# EAGLE design led_cube_4x4x8_v1 (EAGLE 9.6.2)
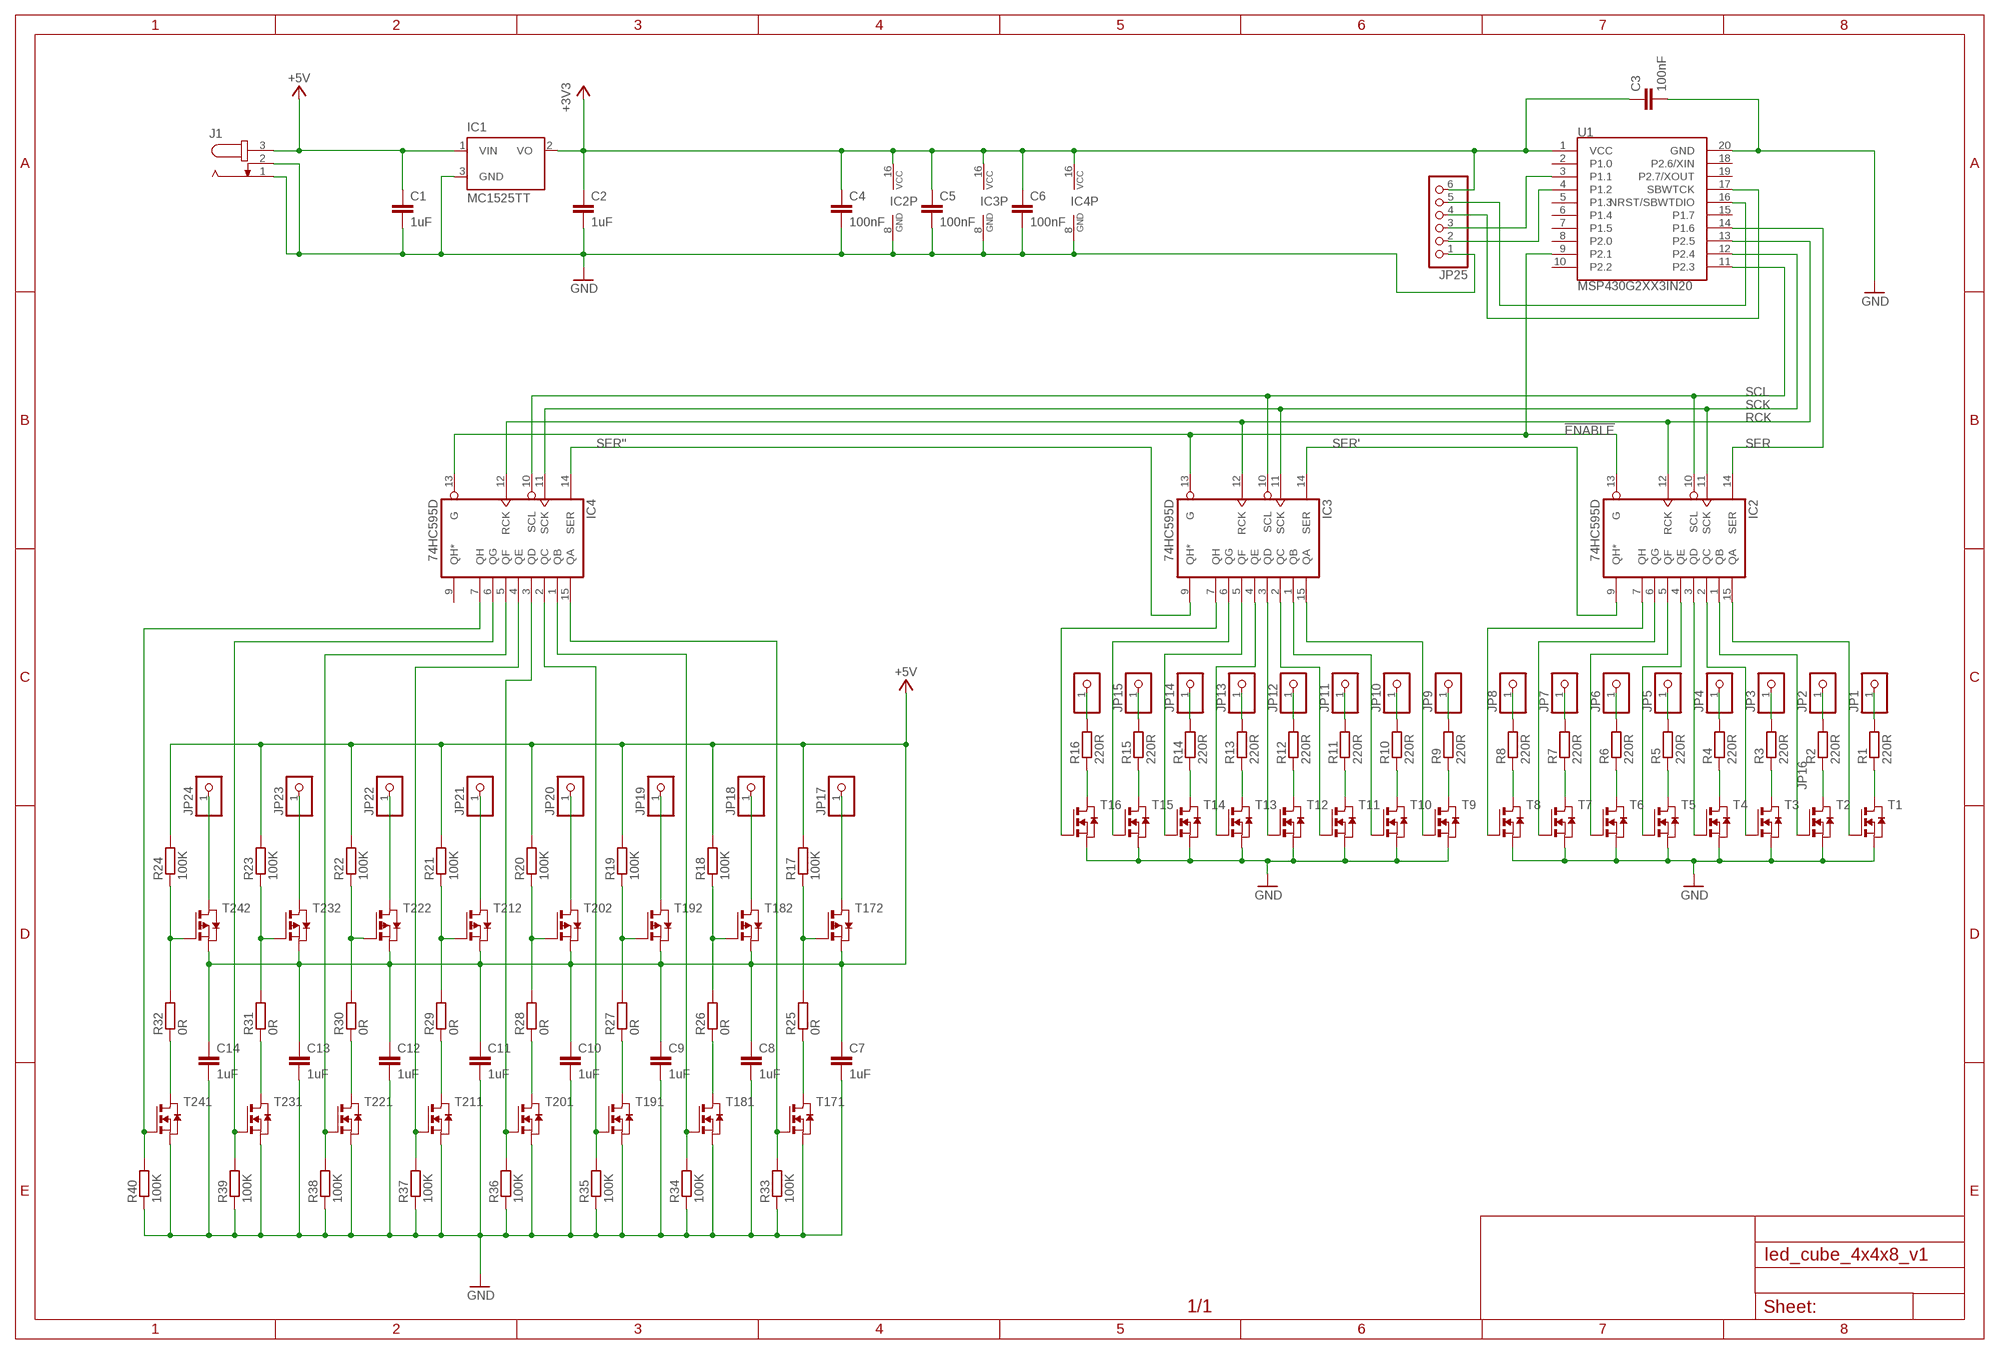
[diagram p0: schematic, sheet 1]

## Parts
C1  1uF  C-EUC0603  [C0603]
C2  1uF  C-EUC0603  [C0603]
C3  100nF  C-EUC0603  [C0603]
C4  100nF  C-EUC0603  [C0603]
C5  100nF  C-EUC0603  [C0603]
C6  100nF  C-EUC0603  [C0603]
C7  1uF  C-EUC0603  [C0603]
C8  1uF  C-EUC0603  [C0603]
C9  1uF  C-EUC0603  [C0603]
C10  1uF  C-EUC0603  [C0603]
C11  1uF  C-EUC0603  [C0603]
C12  1uF  C-EUC0603  [C0603]
C13  1uF  C-EUC0603  [C0603]
C14  1uF  C-EUC0603  [C0603]
IC1  MC1525TT  [SOT23]
IC2  74HC595D  [SO16]
IC3  74HC595D  [SO16]
IC4  74HC595D  [SO16]
J1  JACK-PLUG0  [SPC4077]
JP1  PINHD-1X1  [1X01]
JP2  PINHD-1X1  [1X01]
JP3  PINHD-1X1  [1X01]
JP4  PINHD-1X1  [1X01]
JP5  PINHD-1X1  [1X01]
JP6  PINHD-1X1  [1X01]
JP7  PINHD-1X1  [1X01]
JP8  PINHD-1X1  [1X01]
JP9  PINHD-1X1  [1X01]
JP10  PINHD-1X1  [1X01]
JP11  PINHD-1X1  [1X01]
JP12  PINHD-1X1  [1X01]
JP13  PINHD-1X1  [1X01]
JP14  PINHD-1X1  [1X01]
JP15  PINHD-1X1  [1X01]
JP16  PINHD-1X1  [1X01]
JP17  PINHD-1X1  [1X01]
JP18  PINHD-1X1  [1X01]
JP19  PINHD-1X1  [1X01]
JP20  PINHD-1X1  [1X01]
JP21  PINHD-1X1  [1X01]
JP22  PINHD-1X1  [1X01]
JP23  PINHD-1X1  [1X01]
JP24  PINHD-1X1  [1X01]
JP25  PINHD-1X6  [1X06]
R1  220R  R-EU_R0603  [R0603]
R2  220R  R-EU_R0603  [R0603]
R3  220R  R-EU_R0603  [R0603]
R4  220R  R-EU_R0603  [R0603]
R5  220R  R-EU_R0603  [R0603]
R6  220R  R-EU_R0603  [R0603]
R7  220R  R-EU_R0603  [R0603]
R8  220R  R-EU_R0603  [R0603]
R9  220R  R-EU_R0603  [R0603]
R10  220R  R-EU_R0603  [R0603]
R11  220R  R-EU_R0603  [R0603]
R12  220R  R-EU_R0603  [R0603]
R13  220R  R-EU_R0603  [R0603]
R14  220R  R-EU_R0603  [R0603]
R15  220R  R-EU_R0603  [R0603]
R16  220R  R-EU_R0603  [R0603]
R17  100K  R-EU_R0603  [R0603]
R18  100K  R-EU_R0603  [R0603]
R19  100K  R-EU_R0603  [R0603]
R20  100K  R-EU_R0603  [R0603]
R21  100K  R-EU_R0603  [R0603]
R22  100K  R-EU_R0603  [R0603]
R23  100K  R-EU_R0603  [R0603]
R24  100K  R-EU_R0603  [R0603]
R25  0R  R-EU_R0603  [R0603]
R26  0R  R-EU_R0603  [R0603]
R27  0R  R-EU_R0603  [R0603]
R28  0R  R-EU_R0603  [R0603]
R29  0R  R-EU_R0603  [R0603]
R30  0R  R-EU_R0603  [R0603]
R31  0R  R-EU_R0603  [R0603]
R32  0R  R-EU_R0603  [R0603]
R33  100K  R-EU_R0603  [R0603]
R34  100K  R-EU_R0603  [R0603]
R35  100K  R-EU_R0603  [R0603]
R36  100K  R-EU_R0603  [R0603]
R37  100K  R-EU_R0603  [R0603]
R38  100K  R-EU_R0603  [R0603]
R39  100K  R-EU_R0603  [R0603]
R40  100K  R-EU_R0603  [R0603]
T1  NMOSSOT23  [SOT-23]
T2  NMOSSOT23  [SOT-23]
T3  NMOSSOT23  [SOT-23]
T4  NMOSSOT23  [SOT-23]
T5  NMOSSOT23  [SOT-23]
T6  NMOSSOT23  [SOT-23]
T7  NMOSSOT23  [SOT-23]
T8  NMOSSOT23  [SOT-23]
T9  NMOSSOT23  [SOT-23]
T10  NMOSSOT23  [SOT-23]
T11  NMOSSOT23  [SOT-23]
T12  NMOSSOT23  [SOT-23]
T13  NMOSSOT23  [SOT-23]
T14  NMOSSOT23  [SOT-23]
T15  NMOSSOT23  [SOT-23]
T16  NMOSSOT23  [SOT-23]
T17  PN_MOSFET-SOT23-6  [SOT23-6]
T18  PN_MOSFET-SOT23-6  [SOT23-6]
T19  PN_MOSFET-SOT23-6  [SOT23-6]
T20  PN_MOSFET-SOT23-6  [SOT23-6]
T21  PN_MOSFET-SOT23-6  [SOT23-6]
T22  PN_MOSFET-SOT23-6  [SOT23-6]
T23  PN_MOSFET-SOT23-6  [SOT23-6]
T24  PN_MOSFET-SOT23-6  [SOT23-6]
U1  MSP430G2XX3IN20  [DIL20]

## Nets
!ENABLE: IC2.13(G) IC3.13(G) IC4.13(G) U1.9(P2.1)
+3V3 [power]: C2.1 C3.1 C4.1 C5.1 C6.1 IC1.2(VO) IC2.16(VCC) IC3.16(VCC) IC4.16(VCC) JP25.6 U1.1(VCC)
+5V [led_power]: C1.1 C7.1 C8.1 C9.1 C10.1 C11.1 C12.1 C13.1 C14.1 IC1.1(VIN) J1.3 R17.2 R18.2 R19.2 R20.2 R21.2 R22.2 R23.2 R24.2 T17.2(2:S) T18.2(2:S) T19.2(2:S) T20.2(2:S) T21.2(2:S) T22.2(2:S) T23.2(2:S) T24.2(2:S)
GND: C1.2 C2.2 C3.2 C4.2 C5.2 C6.2 C7.2 C8.2 C9.2 C10.2 C11.2 C12.2 C13.2 C14.2 IC1.3(GND) IC2.8(GND) IC3.8(GND) IC4.8(GND) J1.1 J1.2 JP25.1 R33.1 R34.1 R35.1 R36.1 R37.1 R38.1 R39.1 R40.1 T1.2(S) T2.2(S) T3.2(S) T4.2(S) T5.2(S) T6.2(S) T7.2(S) T8.2(S) T9.2(S) T10.2(S) T11.2(S) T12.2(S) T13.2(S) T14.2(S) T15.2(S) T16.2(S) T17.5(1:S) T18.5(1:S) T19.5(1:S) T20.5(1:S) T21.5(1:S) T22.5(1:S) T23.5(1:S) T24.5(1:S) U1.20(GND)
N$2: R22.1 R30.2 T22.3(2:G)
N$7 [led_power]: R8.1 T8.1(D)
N$8 [led_power]: R7.1 T7.1(D)
N$9 [led_power]: R6.1 T6.1(D)
N$10 [led_power]: R5.1 T5.1(D)
N$11 [led_power]: R4.1 T4.1(D)
N$12 [led_power]: R3.1 T3.1(D)
N$13 [led_power]: R2.1 T2.1(D)
N$14 [led_power]: R1.1 T1.1(D)
N$15: IC2.6(QG) T7.3(G)
N$16: IC2.7(QH) T8.3(G)
N$17: IC2.5(QF) T6.3(G)
N$18: IC2.4(QE) T5.3(G)
N$19: IC2.3(QD) T4.3(G)
N$20: IC2.2(QC) T3.3(G)
N$21: IC2.1(QB) T2.3(G)
N$22: IC2.15(QA) T1.3(G)
N$23 [led_power]: JP8.1 R8.2
N$24 [led_power]: JP7.1 R7.2
N$25 [led_power]: JP6.1 R6.2
N$26 [led_power]: JP5.1 R5.2
N$27 [led_power]: JP4.1 R4.2
N$28 [led_power]: JP3.1 R3.2
N$29 [led_power]: JP2.1 R2.2
N$30 [led_power]: JP1.1 R1.2
N$31 [led_power]: R16.1 T16.1(D)
N$32 [led_power]: R15.1 T15.1(D)
N$33 [led_power]: R14.1 T14.1(D)
N$34 [led_power]: R13.1 T13.1(D)
N$35 [led_power]: R12.1 T12.1(D)
N$36 [led_power]: R11.1 T11.1(D)
N$37 [led_power]: R10.1 T10.1(D)
N$38 [led_power]: R9.1 T9.1(D)
N$39: IC3.6(QG) T15.3(G)
N$40: IC3.7(QH) T16.3(G)
N$41: IC3.5(QF) T14.3(G)
N$42: IC3.4(QE) T13.3(G)
N$43: IC3.3(QD) T12.3(G)
N$44: IC3.2(QC) T11.3(G)
N$45: IC3.1(QB) T10.3(G)
N$46: IC3.15(QA) T9.3(G)
N$47 [led_power]: JP16.1 R16.2
N$48 [led_power]: JP15.1 R15.2
N$49 [led_power]: JP14.1 R14.2
N$50 [led_power]: JP13.1 R13.2
N$51 [led_power]: JP12.1 R12.2
N$52 [led_power]: JP11.1 R11.2
N$53 [led_power]: JP10.1 R10.2
N$54 [led_power]: JP9.1 R9.2
N$56: R23.1 R31.2 T23.3(2:G)
N$57: R21.1 R29.2 T21.3(2:G)
N$58: R20.1 R28.2 T20.3(2:G)
N$59: R19.1 R27.2 T19.3(2:G)
N$60: R18.1 R26.2 T18.3(2:G)
N$61: R17.1 R25.2 T17.3(2:G)
N$62 [led_power]: JP24.1 T24.4(2:D)
N$63 [led_power]: JP23.1 T23.4(2:D)
N$64: IC4.7(QH) R40.2 T24.1(1:G)
N$65 [led_power]: JP22.1 T22.4(2:D)
N$66 [led_power]: JP21.1 T21.4(2:D)
N$67 [led_power]: JP20.1 T20.4(2:D)
N$68 [led_power]: JP19.1 T19.4(2:D)
N$69 [led_power]: JP18.1 T18.4(2:D)
N$70 [led_power]: JP17.1 T17.4(2:D)
N$71: IC4.3(QD) R36.2 T20.1(1:G)
N$72: R24.1 R32.2 T24.3(2:G)
N$73: IC4.6(QG) R39.2 T23.1(1:G)
N$74: IC4.5(QF) R38.2 T22.1(1:G)
N$75: IC4.4(QE) R37.2 T21.1(1:G)
N$76: R32.1 T24.6(1:D)
N$77: IC4.2(QC) R35.2 T19.1(1:G)
N$78: IC4.1(QB) R34.2 T18.1(1:G)
N$79: IC4.15(QA) R33.2 T17.1(1:G)
N$81: JP25.2 U1.4(P1.2)
N$82: JP25.3 U1.3(P1.1)
N$83: JP25.4 U1.17(SBWTCK)
N$84: JP25.5 U1.16(NRST/SBWTDIO)
N$85: R31.1 T23.6(1:D)
N$86: R30.1 T22.6(1:D)
N$87: R29.1 T21.6(1:D)
N$88: R28.1 T20.6(1:D)
N$89: R27.1 T19.6(1:D)
N$90: R26.1 T18.6(1:D)
N$91: R25.1 T17.6(1:D)
RCK: IC2.12(RCK) IC3.12(RCK) IC4.12(RCK) U1.13(P2.5)
SCK: IC2.11(SCK) IC3.11(SCK) IC4.11(SCK) U1.12(P2.4)
SCL: IC2.10(SCL) IC3.10(SCL) IC4.10(SCL) U1.11(P2.3)
SER: IC2.14(SER) U1.14(P1.6)
SER': IC2.9(QH*) IC3.14(SER)
SER'': IC3.9(QH*) IC4.14(SER)
Unconnected: IC4.9(QH*) U1.2(P1.0) U1.5(P1.3) U1.6(P1.4) U1.7(P1.5) U1.8(P2.0) U1.10(P2.2) U1.15(P1.7) U1.18(P2.6/XIN) U1.19(P2.7/XOUT)

## Library data of the parts
C1-C14 = custom:C-EU: CAPACITOR, European symbol; SPICEPREFIX: C
IC1 = microchip:MC15*: 2.5V and 4.096V Voltage References Source: http://www.microchip.com .. 21653b.pdf; OC_FARNELL: unknown; OC_NEWARK: unknown
IC2-IC4 = custom:74*595: 8-bit SHIFT REGISTER, output latch
J1 = custom:JACK-PLUG: DC POWER JACK Power Jack, DC, Right Angle, Through Hole, Rated 5A at 16VDC, PC Terminals Distributor: Farnell (www.Farnell.de) Drawing: 84N1161.pdf / 84N1162.pdf Manufacturer: SPC Technology (www.spctechnology.com) Type: SPC4077 / SPC 4078; OC_FARNELL: unknown; OC_NEWARK: unknown
JP1-JP24 = pinhead:PINHD-1X1: PIN HEADER
JP25 = pinhead:PINHD-1X6: PIN HEADER
R1-R40 = rcl:R-EU_: RESISTOR, European symbol; SPICEPREFIX: R
T1-T16 = zetex:NMOSSOT23: MOS FET; OC_FARNELL: unknown; OC_NEWARK: unknown
T17-T24 = custom:PN_MOSFET-: DUAL N AND P-CHANNEL ENHANCEMENT MODE MOSFET Source: Data sheet <http://www.farnell.com/datasheets/1693880.pdf>
U1 = custom:MSP430G2XX3

## Net classes
0 default: width 0.254 mm, drill 0.3 mm, clearance 0.254 mm
1 led_power: width 0.635 mm, drill 0.3 mm, clearance 0.254 mm
2 power: width 0.508 mm, drill 0.3 mm, clearance 0.254 mm

## Board
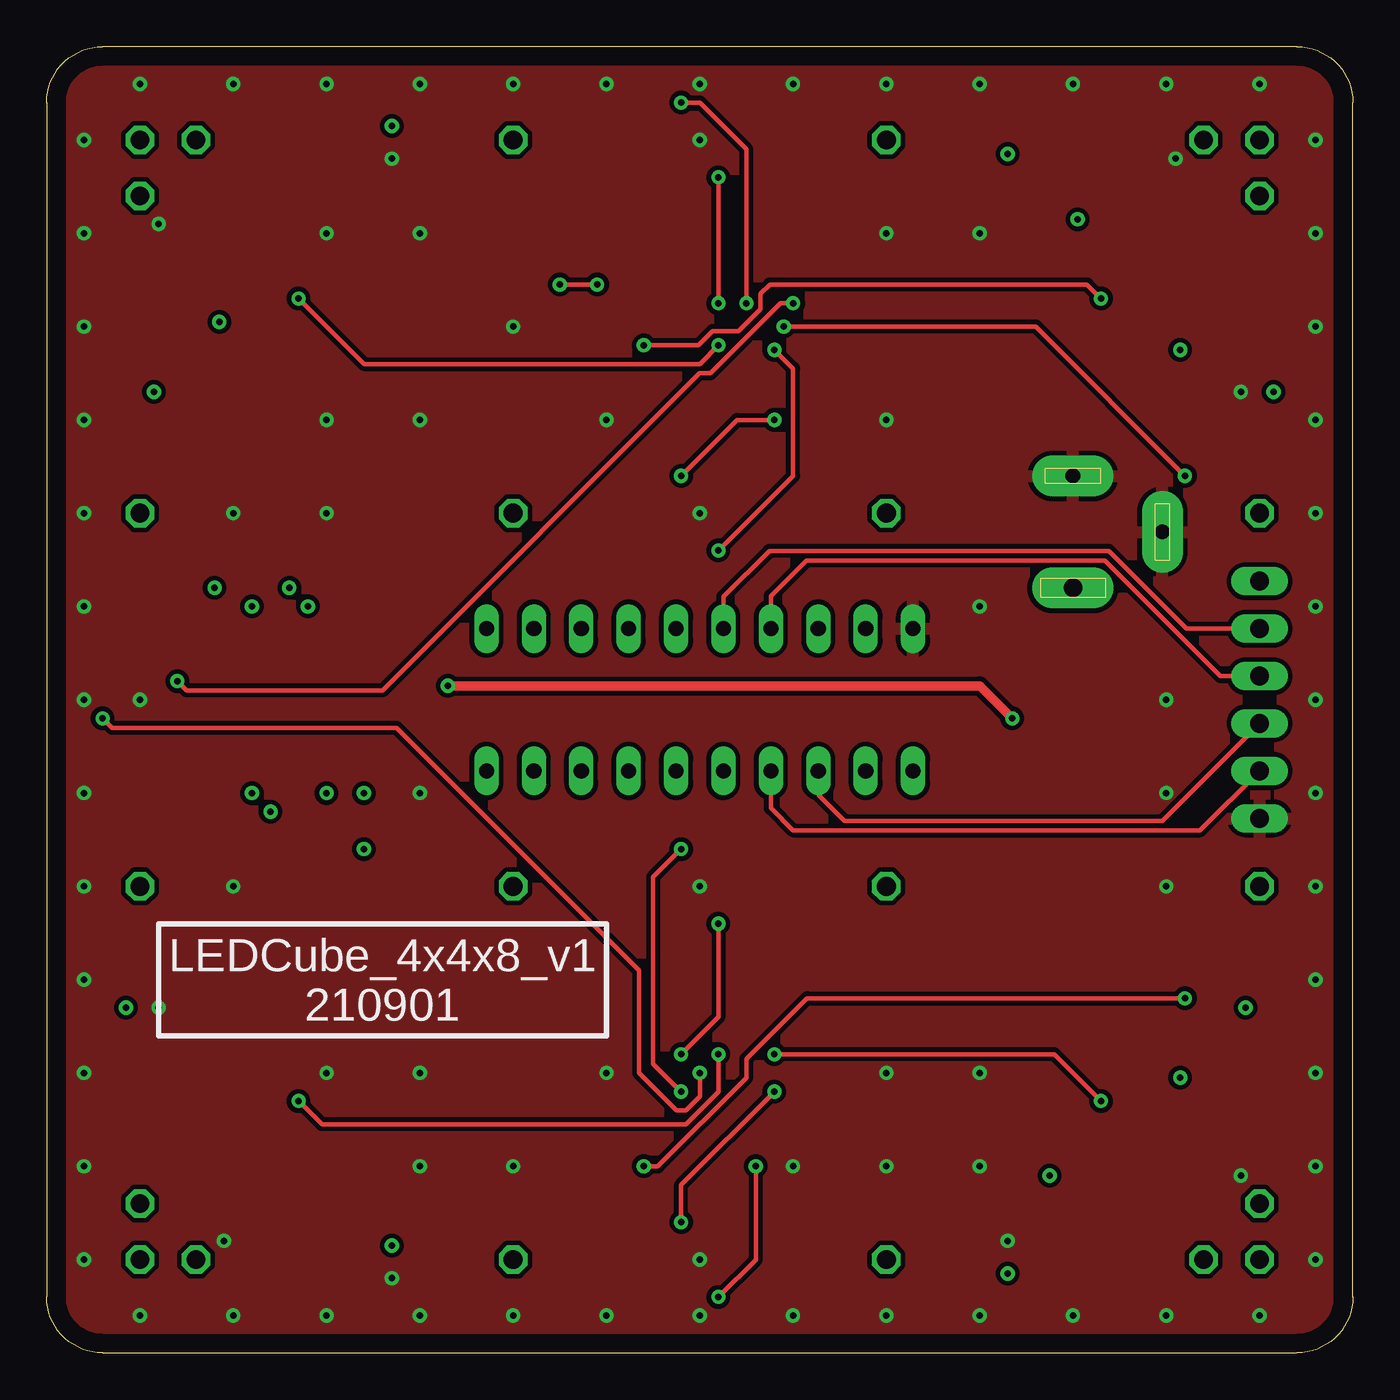
[diagram p1: board, top side]
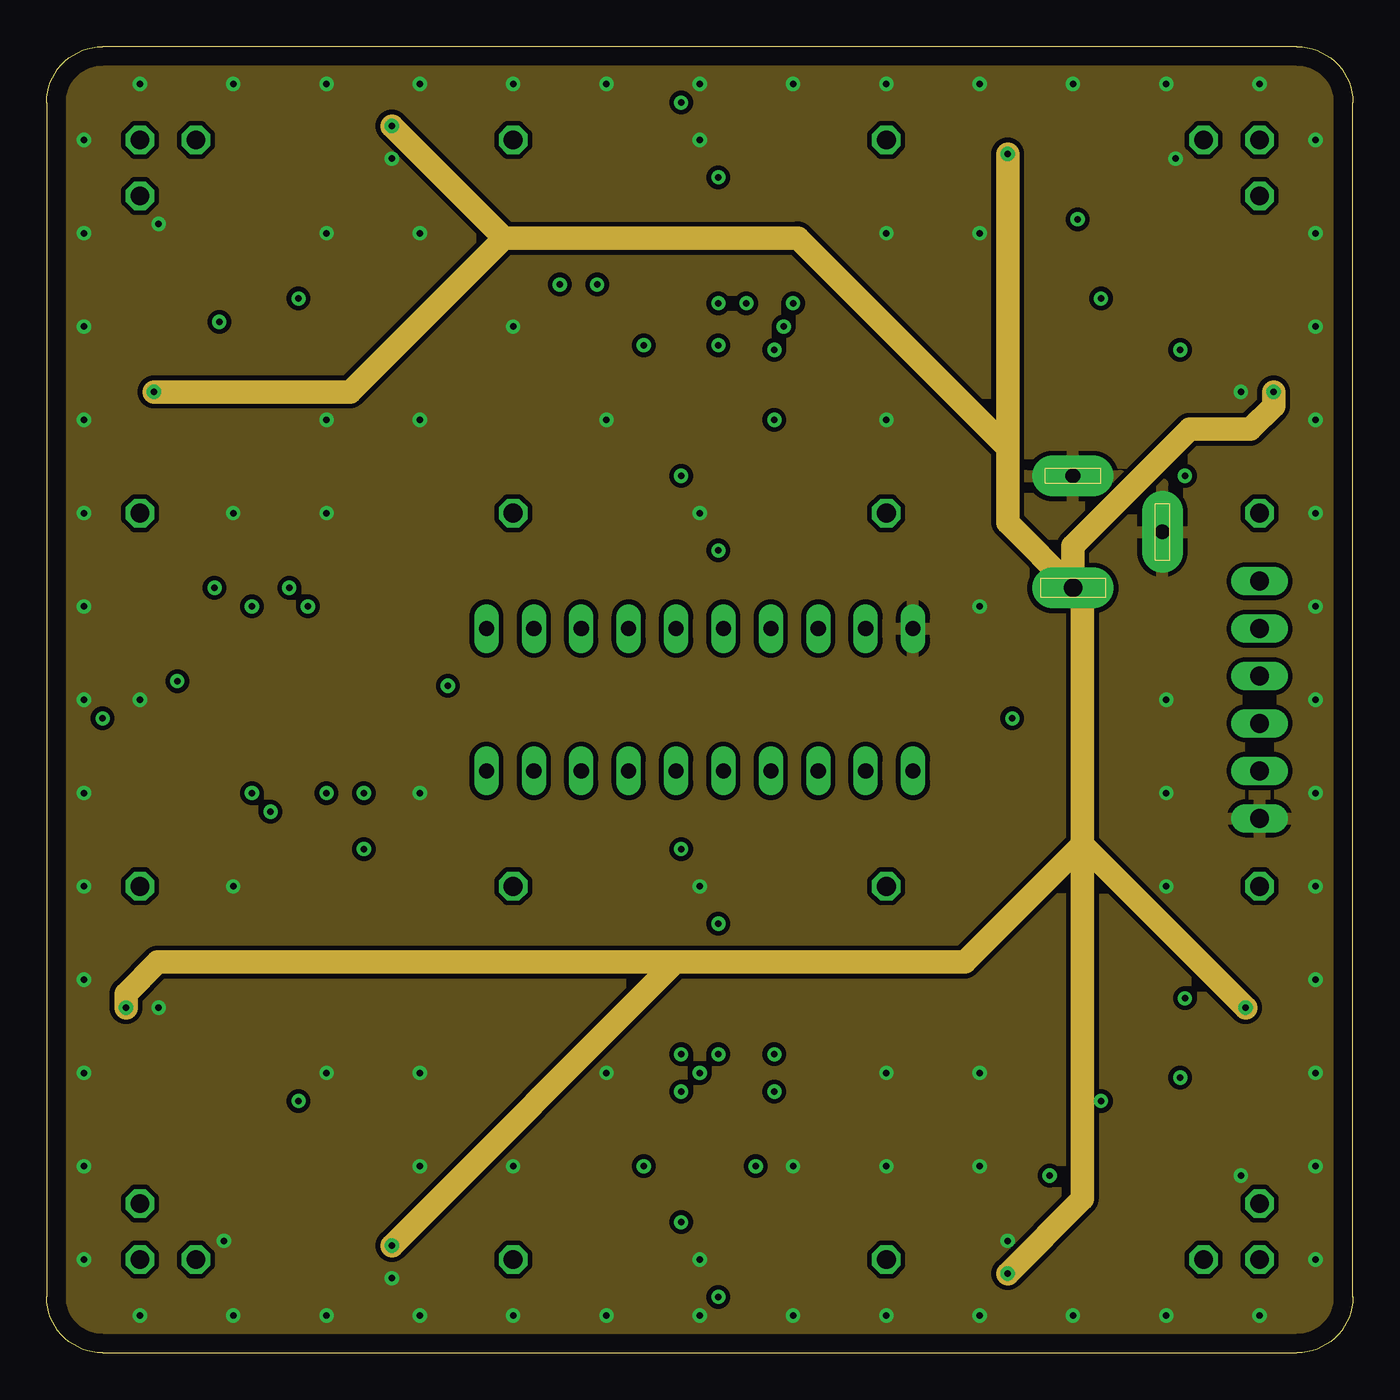
[diagram p2: board, inner layer Route2]
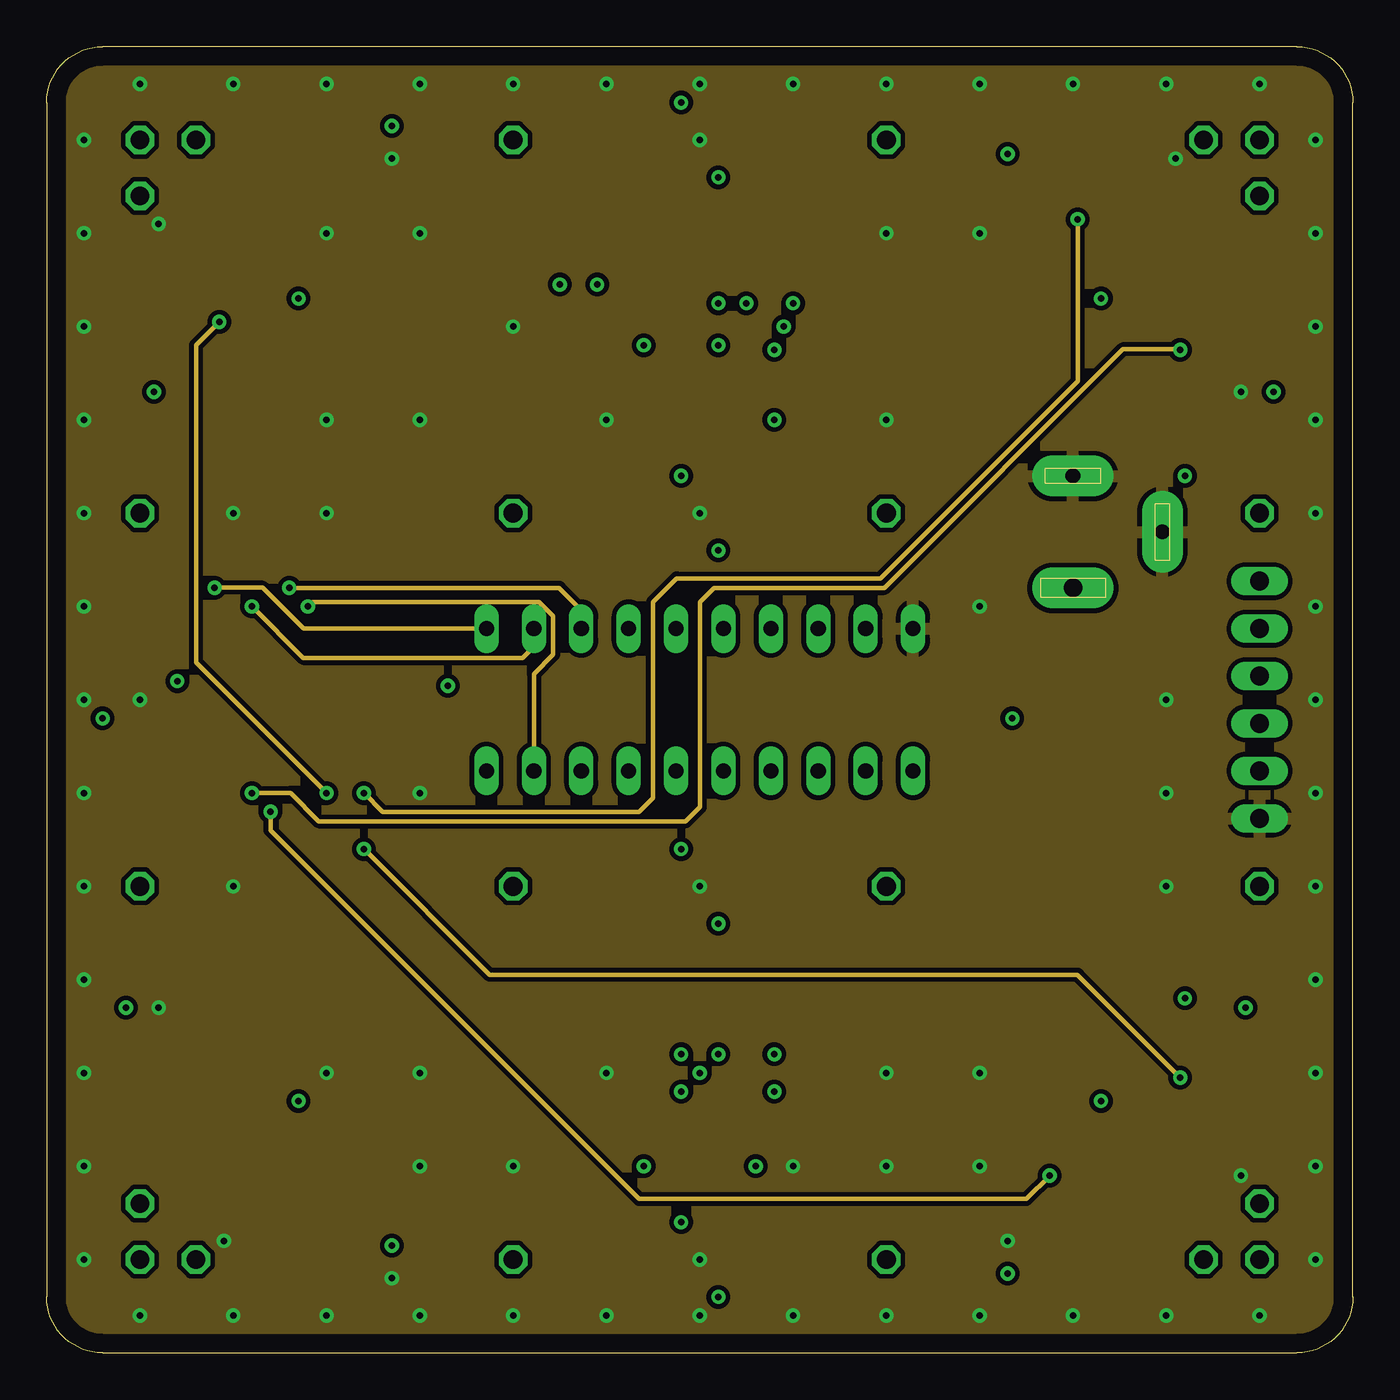
[diagram p3: board, inner layer Route15]
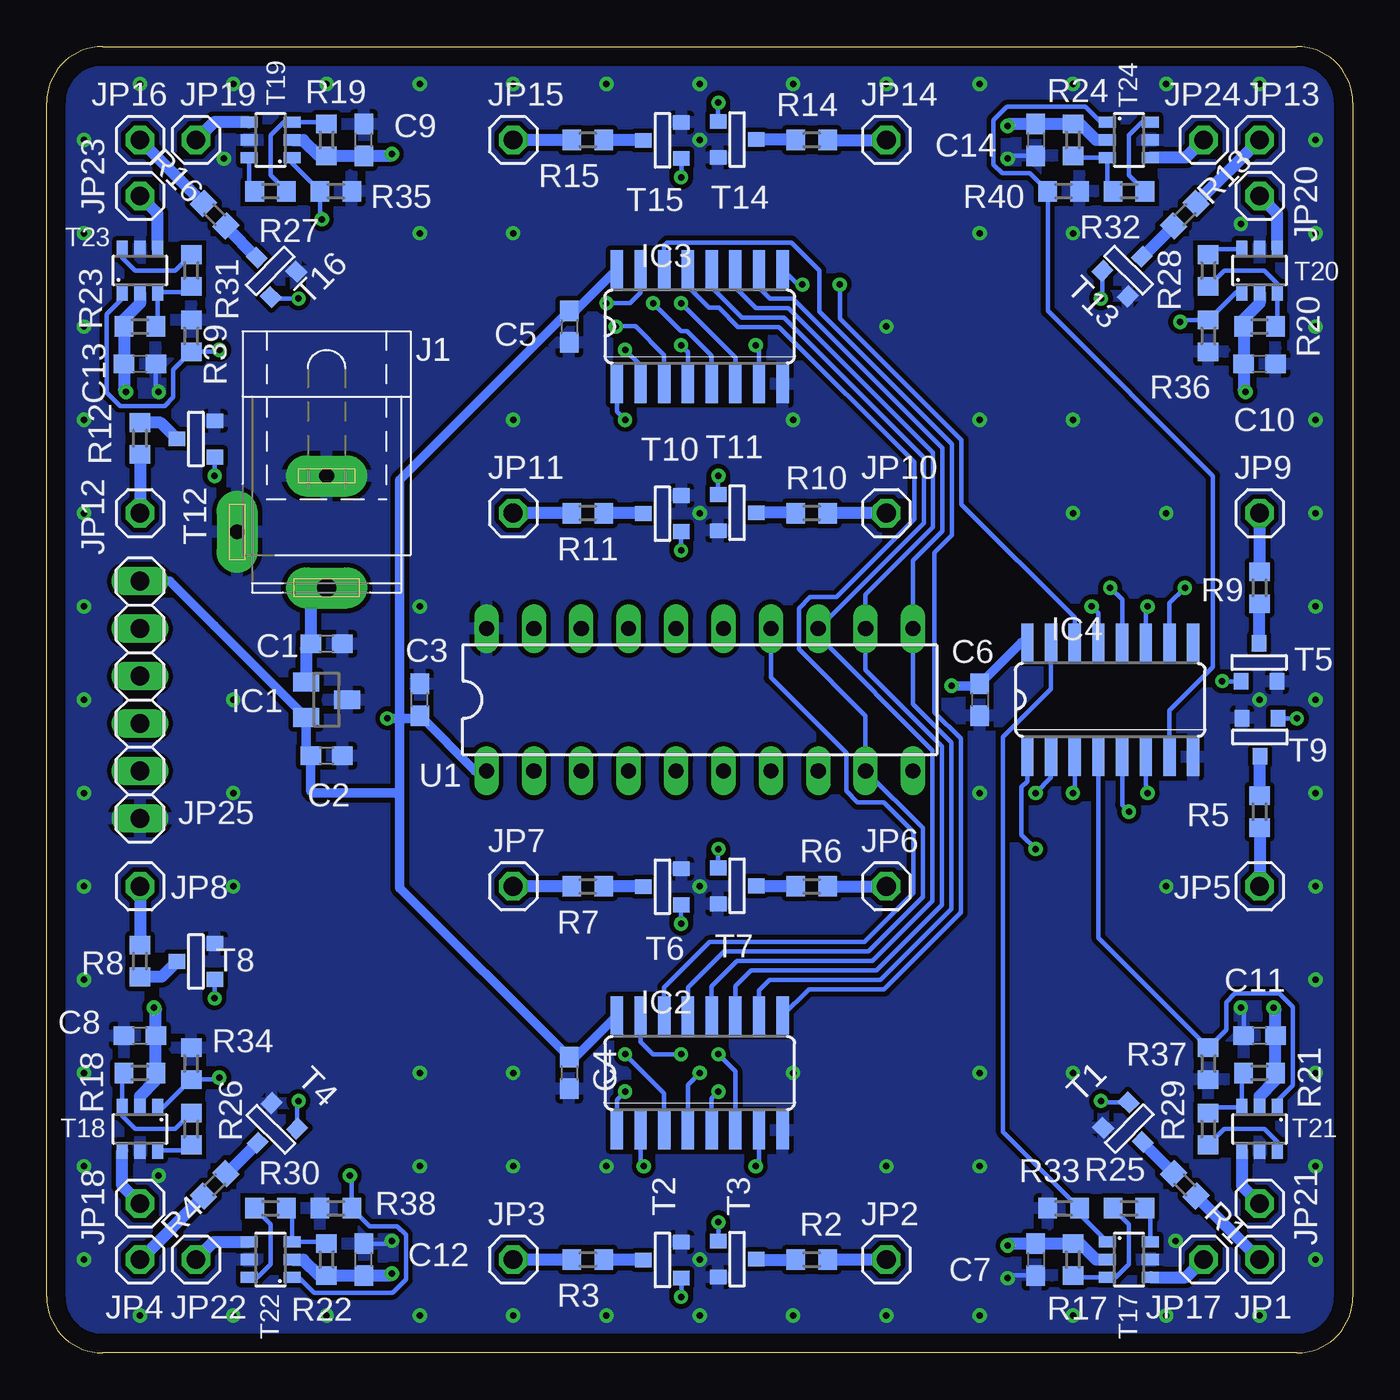
[diagram p4: board, bottom side, seen from below]

Size 70 x 70 mm. Coordinates in mm from the lower left corner, seen from the top.
Outline: 3,0 67,0 arc90 70,3 70,67 arc90 67,70 3,70 arc90 0,67 0,3 arc90 3,0
Copper layers (1*2+15*16): Top 0.035mm / dielectric 1.5mm / Route2 0.035mm / dielectric 0.15mm / Route15 0.035mm / dielectric 0.2mm / Bottom 0.035mm
Design rules "default *": minimum track width 6mil, minimum drill 0.35mm, track to track 6mil, track to pad 6mil, pad to pad 6mil, via to via 6mil, smd to smd 6mil, copper to edge 40mil, drill to drill 6mil, minimum pad ring 10mil, minimum via ring 8mil, stop-mask expansion 4mil, vias tented up to drill 0mil, thermal gap 10mil

### Footprints (pad centres in the part's own frame; a part is rotated, then mirrored left to right if it is on the bottom)
C0603 = smd 1.1 x 1: 1 -0.85,0; 2 0.85,0
SOT23 = smd 1 x 1.4: 1 -0.95,-1.1; 2 0.95,-1.1; 3 0,1.1
SO16 = smd 0.66 x 2.032: 1 -4.445,-3.073; 2 -3.175,-3.073; 3 -1.905,-3.073; 4 -0.635,-3.073; 5 0.635,-3.073; 6 1.905,-3.073; 7 3.175,-3.073; 8 4.445,-3.073; 9 4.445,3.073; 10 3.175,3.073; 11 1.905,3.073; 12 0.635,3.073; 13 -0.635,3.073; 14 -1.905,3.073; 15 -3.175,3.073; 16 -4.445,3.073
SPC4077 = drill 0.8 pad 2.184 long: 1 -3,0; 2 0,-4.8 | drill 1 pad 2.184 long: 3 3,0
1X01 = drill 1.016 octagon: 1 0,0
1X06 = drill 1.016 long: 1 -6.35,0; 2 -3.81,0; 3 -1.27,0; 4 1.27,0; 5 3.81,0; 6 6.35,0
R0603 = smd 1 x 1.1: 1 -0.85,0; 2 0.85,0
SOT-23 = smd 0.787 x 0.889: 1 0.025,-1.016; 2 -0.94,1.016; 3 0.991,1.016
SOT23-6 = smd 0.6 x 0.9: 1 -0.95,-1.15; 2 0,-1.15; 3 0.95,-1.15; 4 0.95,1.15; 5 0,1.15; 6 -0.95,1.15
DIL20 = drill 0.813 long: 1 -11.43,-3.81; 2 -8.89,-3.81; 3 -6.35,-3.81; 4 -3.81,-3.81; 5 -1.27,-3.81; 6 1.27,-3.81; 7 3.81,-3.81; 8 6.35,-3.81; 9 8.89,-3.81; 10 11.43,-3.81; 11 11.43,3.81; 12 8.89,3.81; 13 6.35,3.81; 14 3.81,3.81; 15 1.27,3.81; 16 -1.27,3.81; 17 -3.81,3.81; 18 -6.35,3.81; 19 -8.89,3.81; 20 -11.43,3.81

### Placement (x,y rotation side)
C1  55,38 0 bottom
C2  55,32 0 bottom
C3  50,35 90 bottom
C4  42,15 270 bottom
C5  42,55 270 bottom
C6  20,35 270 bottom
C7  17,5 270 bottom
C8  65,17 180 bottom
C9  53,65 90 bottom
C10  5,53 0 bottom
C11  5,17 180 bottom
C12  53,5 90 bottom
C13  65,53 0 bottom
C14  17,65 270 bottom
IC1  55,35 270 bottom
IC2  35,15 0 bottom
IC3  35,55 0 bottom
IC4  13,35 0 bottom
J1  55,44 270 bottom
JP1  5,5 0 bottom
JP2  25,5 0 bottom
JP3  45,5 0 bottom
JP4  65,5 0 bottom
JP5  5,25 0 bottom
JP6  25,25 0 bottom
JP7  45,25 0 bottom
JP8  65,25 0 bottom
JP9  5,45 0 bottom
JP10  25,45 0 bottom
JP11  45,45 0 bottom
JP12  65,45 0 bottom
JP13  5,65 0 bottom
JP14  25,65 0 bottom
JP15  45,65 0 bottom
JP16  65,65 0 bottom
JP17  8,5 0 bottom
JP18  65,8 0 bottom
JP19  62,65 0 bottom
JP20  5,62 0 bottom
JP21  5,8 0 bottom
JP22  62,5 0 bottom
JP23  65,62 0 bottom
JP24  8,65 0 bottom
JP25  65,35 90 bottom
R1  9,9 315 bottom
R2  29,5 0 bottom
R3  41,5 180 bottom
R4  61,9 225 bottom
R5  5,29 270 bottom
R6  29,25 0 bottom
R7  41,25 180 bottom
R8  65,21 90 bottom
R9  5,41 90 bottom
R10  29,45 0 bottom
R11  41,45 180 bottom
R12  65,49 270 bottom
R13  9,61 45 bottom
R14  29,65 0 bottom
R15  41,65 180 bottom
R16  61,61 135 bottom
R17  15,5 90 bottom
R18  65,15 0 bottom
R19  55,65 270 bottom
R20  5,55 180 bottom
R21  5,15 0 bottom
R22  55,5 270 bottom
R23  65,55 180 bottom
R24  15,65 90 bottom
R25  12,7.75 180 bottom
R26  62.25,12 90 bottom
R27  58,62.25 0 bottom
R28  7.75,58 270 bottom
R29  7.75,12 90 bottom
R30  58,7.75 0 bottom
R31  62.25,58 270 bottom
R32  12,62.25 180 bottom
R33  15.5,7.75 0 bottom
R34  62.25,15.5 270 bottom
R35  54.5,62.25 180 bottom
R36  7.75,54.5 90 bottom
R37  7.75,15.5 90 bottom
R38  54.5,7.75 0 bottom
R39  62.25,54.5 270 bottom
R40  15.5,62.25 180 bottom
T1  12,12 45 bottom
T2  33,5 90 bottom
T3  37,5 270 bottom
T4  58,12 315 bottom
T5  5,33 0 bottom
T6  33,25 90 bottom
T7  37,25 270 bottom
T8  62,21 270 bottom
T9  5,37 180 bottom
T10  33,45 90 bottom
T11  37,45 270 bottom
T12  62,49 270 bottom
T13  12,58 135 bottom
T14  33,65 90 bottom
T15  37,65 270 bottom
T16  58,58 225 bottom
T17  12,5 270 bottom
T18  65,12 180 bottom
T19  58,65 90 bottom
T20  5,58 0 bottom
T21  5,12 180 bottom
T22  58,5 90 bottom
T23  65,58 0 bottom
T24  12,65 270 bottom
U1  35,35 0 bottom

### Tracks (layer width: path | path; a pad name or v marks a point on that pad's centre or on a via)
!ENABLE  (via drill 0.35)
  Route15 0.254: U1.9 26.11,36.39 27.15,37.43 27.15,39.49 26.39,40.25 14.25,40.25 v14,40
  Bottom 0.254: IC2.13 35.63,19.58 33.71,21.51 25.96,21.51 23.04,24.43 23.04,28.12 U1.9 26.11,34.14 29.69,37.72 29.69,39.9 29.08,40.51 27.67,40.51 23.51,44.67 23.51,47.73 30.75,54.98 32.94,54.98 33.98,56.01 34.51,56.01 35.63,57.13 IC3.13 | IC4.13 13.63,39.63 v14,40
+3V3  (via drill 0.35)
  Top 0.508: v21.5,35.75 50,35.75 v51.75,34
  Bottom 0.254: 55.85,30.1 55.75,30
  Bottom 0.508: IC3.16 41.67,55.85 C5.1 51.08,46.77 51.08,34 | IC2.16 41.67,15.85 C4.1 51.08,24.93 51.08,30 | IC4.16 17.78,38.07 C6.1 20.1,35.75 v21.5,35.75 | U1.1 47.04,31.19 C3.1 50.15,34 51.08,34 | 55.85,30.1 C2.1 56.1,32.25 IC1.2 61.02,38.98 63.4,41.35 JP25.6 | 51.08,34 51.08,30 | 55.75,30 51.08,30 | v51.75,34 51.08,34
+5V  (via drill 0.35)
  Route2 1.27: J1.3 55,43.25 61.25,49.5 64.5,49.5 65.75,50.75 v65.75,51.5 | J1.3 51.5,44.5 51.5,48.5 | 51.5,48.5 v51.5,64.25 | v18.5,65.75 24.5,59.75 | 24.5,59.75 40.25,59.75 51.5,48.5 | 24.5,59.75 16.25,51.5 v5.75,51.5 | J1.3 55.5,40.5 55.5,27.25 | 55.5,27.25 v64.25,18.5 | 55.5,27.25 55.5,8.25 v51.5,4.25 | v18.5,5.75 33.7,20.95 | 33.7,20.95 49.2,20.95 55.5,27.25 | 33.7,20.95 5.95,20.95 4.25,19.25 v4.25,18.5
  Bottom 0.635: T20.2 5,56.24 5.85,55.39 R20.2 C10.1 5.85,51.6 v5.75,51.5 | T24.2 13.76,65 14.61,65.85 R24.2 C14.1 18.4,65.85 v18.5,65.75 | T21.2 5,13.76 4.15,14.61 R21.2 C11.1 4.15,18.4 v4.25,18.5 | T17.2 13.76,5 14.61,5.85 R17.2 C7.1 18.4,5.85 v18.5,5.75 | T22.2 56.24,5 55.39,4.15 R22.2 C12.1 51.6,4.15 v51.5,4.25 | T18.2 65,13.76 64.15,14.61 R18.2 C8.1 64.15,18.4 v64.25,18.5 | T23.2 65,56.24 65.85,55.39 R23.2 C13.1 65.85,51.6 v65.75,51.5 | T19.2 56.24,65 55.39,64.15 R19.2 C9.1 51.6,64.15 v51.5,64.25 | IC1.1 56.1,37.75 C1.1 55.85,40.15 J1.3
GND  (via drill 0.35)
  Bottom 0.254: C11.2 5.85,18.35 v6,18.5 | C7.2 18.35,4.15 v18.5,4 | C12.2 51.65,5.85 v51.5,6 | C13.2 64.15,51.65 v64,51.5 | C14.2 18.35,64.15 v18.5,64
  other vias: 2,10 2,5 5,2 10,2 15,2 20,2 25,2 30,2 35,2 40,2 45,2 50,2 55,2 60,2 65,2 68,5 68,10 68,15 68,20 68,25 68,30 68,35 68,40 68,45 68,50 68,55 68,60 68,65 65,68 60,68 55,68 50,68 45,68 40,68 35,68 30,68 25,68 20,68 15,68 10,68 5,68 2,65 2,60 2,55 2,50 2,45 2,40 2,35 2,30 2,25 2,20 2,15 10,25 15,15 20,15 20,10 25,10 45,10 50,10 50,15 45,15 40,10 60,25 15,45 10,45 20,50 25,55 20,60 45,60 50,60 45,50 50,40 60,35 60,30 20,30 30,15 30,50 15,50 15,60 35,25 35,45 35,65 35,5 5,35 9.5,6 64,9.5 60.5,64 6,60.5
  pour Bottom (rank 6): -1,71 71,71 71,-1 -1,-1
  pour Route15 (rank 6): -2,72 72,72 72,-2 -2,-2
  pour Route2 (rank 6): -3,73 73,73 73,-3 -3,-3
  pour Top (rank 6): -4,74 74,74 74,-4 -4,-4
N$2
  Bottom 0.254: R22.1 55.1,5.95 T22.3 56.85,7.45 R30.2
N$7
  Bottom 0.635: T8.1 63.84,20.15 R8.1
N$8
  Bottom 0.635: T7.1 38.04,25 R7.1
N$9
  Bottom 0.635: T6.1 29.88,25.02 R6.1
N$10
  Bottom 0.635: R5.1 5,31.96 T5.1
N$11
  Bottom 0.635: T4.1 60.36,9.6 R4.1
N$12
  Bottom 0.635: T3.1 40.02,4.97 R3.1
N$13
  Bottom 0.635: T2.1 31.96,5 R2.1
N$14
  Bottom 0.635: R1.1 11.26,11.26 T1.1
N$15  (via drill 0.35)
  Top 0.254: v36,23 36,18 v34,16
  Bottom 0.254: T7.3 36,23.99 v36,23 | v34,16 33.09,15.1 IC2.6
N$16  (via drill 0.35)
  Top 0.254: v32,10 v32.01,9.99 32.74,9.99 37.5,14.75 37.5,15.75 40.75,19 v61,19
  Bottom 0.254: T8.3 60.98,19.02 v61,19 | v32,10 31.82,10.18 IC2.7
N$17  (via drill 0.35)
  Top 0.254: v34,27 32.5,25.5 32.5,15.5 v34,14
  Bottom 0.254: T6.3 34.02,26.98 v34,27 | v34,14 34.37,13.63 IC2.5
N$18  (via drill 0.35)
  Top 0.254: v3,34 3.5,33.5 18.75,33.5 31.75,20.5 31.75,15 33.75,13 34.25,13 35,13.75 v35,15
  Bottom 0.254: T5.3 3.99,34 v3,34 | IC2.4 35.63,14.37 v35,15
N$19  (via drill 0.35)
  Top 0.254: v56.5,13.5 54,16 v39,16
  Bottom 0.254: T4.3 56.58,13.42 v56.5,13.5 | v39,16 36.91,13.9 IC2.3
N$20  (via drill 0.35)
  Top 0.254: v36,3 38,5 v38,10
  Bottom 0.254: T3.3 35.98,3.02 v36,3 | IC2.2 38.17,10.18 v38,10
N$21  (via drill 0.35)
  Top 0.254: v34,7 34,9 v39,14
  Bottom 0.254: T2.3 34,6.01 v34,7 | IC2.1 39.45,13.55 v39,14
N$22  (via drill 0.35)
  Top 0.254: v36,16 36,14 34.25,12.25 14.75,12.25 v13.5,13.5
  Bottom 0.254: T1.3 13.42,13.42 v13.5,13.5 | IC2.15 38.17,16.68 37.5,16 v36,16
N$23
  Bottom 0.635: JP8.1 R8.2
N$24
  Bottom 0.635: R7.2 JP7.1
N$25
  Bottom 0.635: R6.2 JP6.1
N$26
  Bottom 0.635: R5.2 JP5.1
N$27
  Bottom 0.635: R4.2 JP4.1
N$28
  Bottom 0.635: R3.2 JP3.1
N$29
  Bottom 0.635: JP2.1 R2.2
N$30
  Bottom 0.635: 8.33,8.33 R1.2 | JP1.1 R1.2 | R1.2
N$31
  Bottom 0.635: T16.1 60.33,60.29 R16.1
N$32
  Bottom 0.635: T15.1 38.04,65 R15.1
N$33
  Bottom 0.635: R14.1 29.98,65.03 T14.1
N$34
  Bottom 0.635: T13.1 11.26,58.74 R13.1
N$35
  Bottom 0.635: T12.1 63.89,49.85 R12.1
N$36
  Bottom 0.635: T11.1 38.04,45 R11.1
N$37
  Bottom 0.635: R10.1 29.88,45.02 T10.1
N$38
  Bottom 0.635: T9.1 5.03,40.02 R9.1
N$39  (via drill 0.35)
  Top 0.254: v36,56.25 v36,63
  Bottom 0.254: T15.3 35.98,63.02 v36,63 | v36,56.25 33.09,53.34 IC3.6
N$40  (via drill 0.35)
  Top 0.254: v56.5,56.5 55.75,57.25 38.75,57.25 38.26,56.76 38.26,55.94 37.08,54.76 35.69,54.76 34.93,54 v32,54
  Bottom 0.254: T16.3 57.9,56.5 v56.5,56.5 | v32,54 31.82,53.83 IC3.7
N$41  (via drill 0.35)
  Top 0.254: v37.5,56.25 37.5,64.5 35,67 v34,67
  Bottom 0.254: T14.3 34.02,66.98 v34,67 | IC3.5 34.37,53.44 35.69,54.76 36.01,54.76 v37.5,56.25
N$42  (via drill 0.35)
  Top 0.254: v13.5,56.5 17,53 35,53 v36,54
  Bottom 0.254: T13.3 13.42,56.58 v13.5,56.5 | v36,54 35.63,53.63 IC3.4
N$43  (via drill 0.35)
  Top 0.254: v61,47 53,55 v39.5,55
  Bottom 0.254: T12.3 60.98,47.02 v61,47 | v39.5,55 v39.49,55.01 38.44,55.01 36.91,53.48 IC3.3
N$44  (via drill 0.35)
  Top 0.254: v36,43 40,47 40,52.75 v39,53.75
  Bottom 0.254: T11.3 36,43.99 v36,43 | v39,53.75 38.17,52.92 IC3.2
N$45  (via drill 0.35)
  Top 0.254: v34,47 37,50 v39,50
  Bottom 0.254: T10.3 34.02,46.98 v34,47 | v39,50 39.45,50.45 IC3.1
N$46  (via drill 0.35)
  Top 0.254: v7,36 7.5,35.5 18,35.5 34.99,52.49 35.57,52.49 39.32,56.25 v40,56.25
  Bottom 0.254: T9.3 6.98,35.98 v7,36 | v40,56.25 38.75,56.25 38.17,56.83 IC3.15
N$47
  Bottom 0.635: JP16.1 R16.2 | JP16.1
N$48
  Bottom 0.635: R15.2 JP15.1
N$49
  Bottom 0.635: R14.2 JP14.1
N$50
  Bottom 0.635: JP13.1 R13.2
N$51
  Bottom 0.635: R12.2 JP12.1
N$52
  Bottom 0.635: R11.2 JP11.1
N$53
  Bottom 0.635: JP10.1 R10.2
N$54
  Bottom 0.635: R9.2 JP9.1
N$56
  Bottom 0.254: R31.2 62.55,56.85 T23.3 64.05,55.1 R23.1
N$57
  Bottom 0.254: R21.1 5.95,14.9 T21.3 7.45,13.15 R29.2
N$58
  Bottom 0.254: R28.2 6.9,58 4.75,58 4.05,57.3 T20.3 4.05,55.1 R20.1
N$59
  Bottom 0.254: R19.1 55.1,65.95 T19.3 57.3,65.95 58,65.25 58,63.1 R27.2
N$60
  Bottom 0.254: R26.2 63.1,12 65.25,12 65.95,12.7 T18.3 65.95,14.9 R18.1
N$61
  Bottom 0.254: R17.1 14.9,4.05 T17.3 12.7,4.05 12,4.75 12,6.9 R25.2
N$62
  Bottom 0.635: T24.4 8.95,64.05 JP24.1
N$63
  Bottom 0.635: T23.4 64.05,61.05 JP23.1
N$64
  Bottom 0.254: IC4.7 9.82,34.42 7.5,36.75 7.5,47 16.35,55.85 R40.2 17.32,63.22 18.79,63.22 19.26,63.69 19.26,66.06 18.54,66.78 14.34,66.78 13.51,65.95 T24.1
N$65
  Bottom 0.635: T22.4 61.05,5.95 JP22.1
N$66
  Bottom 0.635: T21.4 5.95,8.95 JP21.1
N$67
  Bottom 0.635: T20.4 4.05,61.05 JP20.1
N$68
  Bottom 0.635: T19.4 61.05,65.95 JP19.1
N$69
  Bottom 0.635: T18.4 65.95,8.95 JP18.1
N$70
  Bottom 0.635: T17.4 8.95,4.05 JP17.1
N$71  (via drill 0.35)
  Route15 0.254: v15,30 8,37 8,54 v9.25,55.25
  Bottom 0.254: T20.1 6.25,56.85 R36.2 9.15,55.35 v9.25,55.25 | IC4.3 14.9,30.09 v15,30
N$72
  Bottom 0.254: R24.1 14.9,64.05 T24.3 13.15,62.55 R32.2
N$73  (via drill 0.35)
  Route15 0.254: v11,30 v11.01,30.01 13.06,30.01 14.58,28.49 34.24,28.49 35,29.25 35,40.25 35.75,41 44.9,41 57.68,53.78 60.72,53.78 v60.75,53.75
  Bottom 0.254: IC4.6 11.1,30.09 v11,30 | v60.75,53.75 60.85,53.65 R39.2 63.22,52.68 63.22,51.21 63.69,50.74 66.06,50.74 66.78,51.46 66.78,55.66 65.95,56.49 T23.1
N$74  (via drill 0.35)
  Route15 0.254: v53.75,9.5 52.5,8.25 31.75,8.25 12,28 v12,29
  Bottom 0.254: IC4.5 12.37,29.36 v12,29 | v53.75,9.5 53.65,9.4 R38.2 52.68,6.78 51.21,6.78 50.74,6.31 50.74,3.94 51.46,3.22 55.66,3.22 56.49,4.05 T22.1
N$75
  Bottom 0.254: IC4.4 13.63,22.23 R37.2 6.78,17.32 6.78,18.79 6.31,19.26 3.94,19.26 3.22,18.54 3.22,14.34 4.05,13.51 T21.1
N$76
  Bottom 0.254: T24.6 11.3,65.95 12,65.25 12,63.1 R32.1
N$77  (via drill 0.35)
  Route15 0.254: v17,30 18,29 31.75,29 32.5,29.75 32.5,40.25 33.76,41.51 44.69,41.51 55.25,52.07 v55.25,60.75
  Bottom 0.254: T19.1 56.85,63.75 R35.2 55.35,60.85 v55.25,60.75 | IC4.2 16.18,30.82 v17,30
N$78  (via drill 0.35)
  Route15 0.254: v60.75,14.75 55.24,20.26 23.74,20.26 v17,27
  Bottom 0.254: T18.1 63.75,13.15 R34.2 60.85,14.65 v60.75,14.75 | IC4.1 17.45,30.63 17.76,30.31 17.76,27.76 v17,27
N$79
  Bottom 0.254: T17.1 14.65,7.45 R33.2 18.75,11.85 18.75,32 18.75,33 16.18,35.58 IC4.15
N$81
  Top 0.254: U1.4 38.81,29.19 40,28 61.81,28 JP25.2
N$82
  Top 0.254: U1.3 41.35,29.9 42.74,28.51 59.78,28.51 JP25.3
N$83
  Top 0.254: U1.17 38.81,40.56 40.72,42.47 56.7,42.47 62.91,36.27 JP25.4
N$84
  Top 0.254: U1.16 36.27,40.52 38.73,42.98 56.91,42.98 61.08,38.81 JP25.5
N$85
  Bottom 0.254: T23.6 65.95,58.7 65.25,58 63.1,58 R31.1
N$86
  Bottom 0.254: T22.6 58.7,4.05 58,4.75 58,6.9 R30.1
N$87
  Bottom 0.254: T21.6 4.05,11.3 4.75,12 6.9,12 R29.1
N$88
  Bottom 0.254: T20.6 7.45,59.15 R28.1
N$89
  Bottom 0.254: T19.6 59.15,62.55 R27.1
N$90
  Bottom 0.254: T18.6 62.55,10.85 R26.1
N$91
  Bottom 0.254: T17.6 10.85,7.45 R25.1
RCK  (via drill 0.35)
  Route15 0.254: v13,41 27.46,41 28.65,39.81 U1.13
  Bottom 0.254: 34.37,57.46 IC3.12 34.37,57.12 32.73,55.48 30.5,55.48 23,47.98 23,44.46 U1.13 28.65,38.4 22.53,32.28 22.53,24.22 25.75,21 33,21 34.37,19.64 IC2.12 | IC4.12 12.37,40.37 v13,41
SCK  (via drill 0.35)
  Route15 0.254: v11,40 13.75,37.25 25.5,37.25 26.11,37.86 U1.12
  Bottom 0.254: IC2.11 33.09,19.66 32.26,20.49 25.54,20.49 22.02,24.01 22.02,32.49 26.11,36.58 U1.12 26.11,40.63 22.49,44.25 22.49,48.23 30.25,55.99 31.99,55.99 33.09,57.09 IC3.11 | IC4.11 11.1,39.91 v11,40
SCL  (via drill 0.35)
  Route15 0.254: U1.11 13.76,38.81 11.56,41.01 v9.01,41.01 v9,41
  Bottom 0.254: 31.82,57.76 IC3.10 31.82,57.08 31.25,56.5 30,56.5 21.98,48.48 21.98,44.04 23.57,42.45 U1.11 23.57,34.76 21.51,32.7 21.51,23.8 25.33,19.98 31.27,19.98 31.82,19.43 IC2.10 | IC4.10 9.82,40.17 v9,41
SER
  Bottom 0.254: U1.14 31.19,36.19 27.15,32.15 27.15,30.1 26.54,29.49 25.13,29.49 23.55,27.91 23.55,24.64 26.17,22.02 34.48,22.02 36.91,19.59 IC2.14
SER'
  Bottom 0.254: IC2.9 29.15,19.48 25.12,19.48 21,23.59 21,32.91 22.42,34.33 22.42,42.88 21.48,43.83 21.48,48.69 28.59,55.81 28.59,58 30.1,59.5 36.75,59.5 36.91,59.34 IC3.14
SER''  (via drill 0.35)
  Top 0.254: v29.5,57.25 v27.5,57.25
  Bottom 0.254: IC3.9 29.73,57.25 v29.5,57.25 | v27.5,57.25 27.5,55.44 20.97,48.91 20.97,45.47 14.9,39.41 IC4.14

### Text on the board
tPlace: LEDCube_4x4x8_v1 / 210901